# Altium schematic sheet AC_Relay.SchDoc
size A4; SheetNumber: 2; SheetTotal: 13
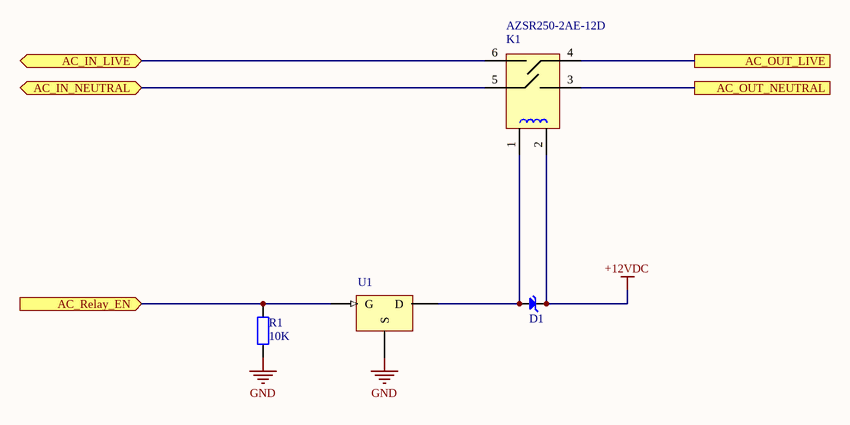
[diagram p0: AC_Relay.SchDoc]

## Parts
D1  SMF16A  [SOD-123H]  (value not drawn)
K1  AZSR250-2AE-12D  [AZSR250]
R1  10K  [RES 0603/1608]
U1  SZNUD3112LT1G  [SZNUD3112LT1G]  (value not drawn)

## Ports
AC_IN_LIVE (bidir), AC_IN_NEUTRAL (bidir), AC_OUT_LIVE, AC_OUT_NEUTRAL, AC_Relay_EN (in)

## Nets
+12VDC: D1.K K1.2
GND: R1.1 U1.2(S)
AC_IN_LIVE: K1.6 ; port AC_IN_LIVE
AC_IN_NEUTRAL: K1.5 ; port AC_IN_NEUTRAL
AC_OUT_LIVE: K1.4 ; port AC_OUT_LIVE
AC_OUT_NEUTRAL: K1.3 ; port AC_OUT_NEUTRAL
AC_Relay_EN: R1.2 U1.1(G) ; port AC_Relay_EN
NetD1_A: D1.A K1.1 U1.3(D)

## Library data of the parts
D1 = SMF16A: Zener Diode; manufacturer: Littelfuse Inc.; Maximun Temperature: 150; Minimum Temperature: -55; Voltage: 16V; inventory_price: 0.36; partnumber: SMF16A; Manufacturer Part Number: SMF16A; URL Datasheet: https://www.littelfuse.com/~/media/electronics/datasheets/tvs_diodes/littelfuse_tvs_diode_smf_datasheet.pdf.pdf; parttype: TVS - Diodes
K1 = AZSR250-2AE-12D: manufacturer: American Zettler; inventory_price: 20.25; partnumber: AZSR250-2AE-12D; Manufacturer Part Number: AZSR250-2AE-12D; URL Datasheet: https://www.azettler.com/pdfs/azsr250.pdf; Digikey PN: 2487-AZSR250-2AE-12D-ND; parttype: Power Relays, Over 2 Amps
R1 = RC0603FR-0710KL: RES SMD 10K OHM 1% 1/10W 0603; Manufacturer: Yageo; Package Imperial: 0603; Package Metric: 1608; Temperature Coefficient: ±100ppm/°C; Power (Watts): 0.1W, 1/10W; Part Number: RC0603FR-0710KL; Value: 10K; Tolerance: ±1%; Digi-Key Part Number: 311-10.0KHRCT-ND
U1 = SZNUD3112LT1GOSCT-ND: manufacturer: ON Semiconductor; inventory_price: 0.93; partnumber: SZNUD3112LT1GOSCT-ND; Manufacturer Part Number: SZNUD3112LT1GOSCT-ND; URL Datasheet: https://www.onsemi.com/pdf/datasheet/nud3112-d.pdf; parttype: PMIC - Power Distribution Switches, Load Drivers